# Altium schematic sheet sensors.SchDoc
size A4
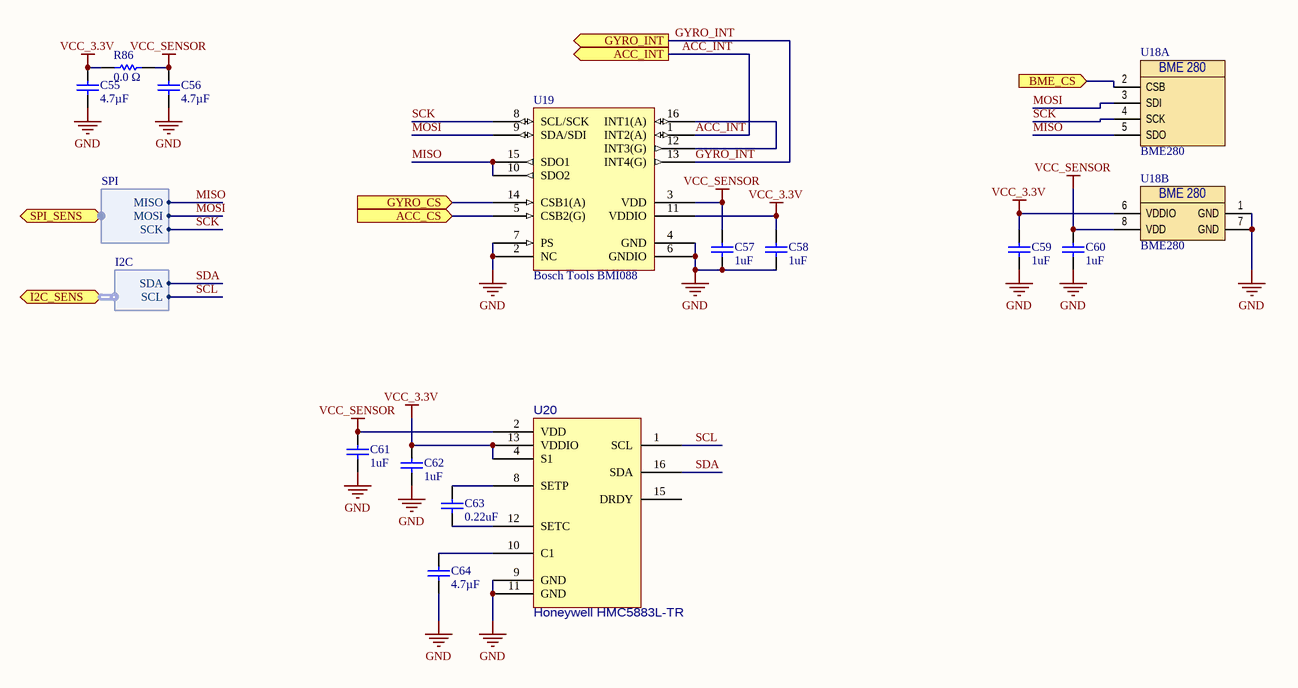
[diagram p0: sensors.SchDoc]

## Parts
C55  4.7µF  [CAPC1608X90X35NL15T15]
C56  4.7µF  [CAPC1608X90X35NL15T15]
C57  1uF  [CAPC1005X56X25NL10T15]
C58  1uF  [CAPC1005X56X25NL10T15]
C59  1uF  [CAPC1005X56X25NL10T15]
C60  1uF  [CAPC1005X56X25NL10T15]
C61  1uF  [CAPC1005X56X25NL10T15]
C62  1uF  [CAPC1005X56X25NL10T15]
C63  0.22uF  [CAPC1005X56X25NL10T15]
C64  4.7µF  [CAPC1608X90X35NL15T15]
R86  0.0 Ω  [RESC1608X55X25LL10T15]
U18  BME280  [PCB-pz4u251hci7fplawf7tn-1]  (parts A,B of 2)
U19  Bosch Tools BMI088  [PCB-rx9ouf6ws7u2trts4ghn-1]
U20  Honeywell HMC5883L-TR  [PCB-2968744-2]

## Ports
ACC_CS (in), ACC_INT (out), BME_CS (in), GYRO_CS (in), GYRO_INT (out), I2C_SENS (harness I2C), SPI_SENS (harness SPI)

## Harnesses
SPI: MOSI, MISO, SCK
I2C: SCL, SDA

## Nets
GND: C55.1 C56.1 C57.1 C58.1 C59.1 C60.1 C61.1 C62.1 C64.2 U18.1(GND) U18.7(GND) U19.2(NC) U19.4(GND) U19.6(GNDIO) U19.7(PS) U20.9(GND) U20.11(GND)
VCC_3.3V: C55.2 C58.2 C59.2 C62.2 R86.2 U18.6(VDDIO) U19.11(VDDIO) U20.4(S1) U20.13(VDDIO)
VCC_SENSOR: C56.2 C57.2 C60.2 C61.2 R86.1 U18.8(VDD) U19.3(VDD) U20.2(VDD)
ACC_CS: U19.5(CSB2(G)) ; port ACC_CS
ACC_INT: U19.1(INT2(A)) ; port ACC_INT
BME_CS: U18.2(CSB) ; port BME_CS
GYRO_CS: U19.14(CSB1(A)) ; port GYRO_CS
GYRO_INT: U19.13(INT4(G)) ; port GYRO_INT
MISO: U18.5(SDO) U19.10(SDO2) U19.15(SDO1) ; port SPI_SENS.MISO
MOSI: U18.3(SDI) U19.9(SDA/SDI) ; port SPI_SENS.MOSI
SCK: U18.4(SCK) U19.8(SCL/SCK) ; port SPI_SENS.SCK
SCL: U20.1(SCL) ; port I2C_SENS.SCL
SDA: U20.16(SDA) ; port I2C_SENS.SDA
NetC63_1: C63.1 U20.12(SETC)
NetC63_2: C63.2 U20.8(SETP)
NetC64_1: C64.1 U20.10(C1)
NetU19_12: U19.12(INT3(G)) U19.16(INT1(A))

Not connected (* = marked no-connect by the designer): U20 15(DRDY)

## Notes on the sheet
- (in symbol CMP-19345792-15, part A) BME 280
- (in symbol CMP-19345792-15, part B) BME 280

## Library data of the parts
C55 C56 C64 = CMP-147010-6: 0603 4.7 uF 10 V ±10 % Tolerance X5R SMT Multilayer Ceramic Capacitor; Voltage Rating (DC): 10.0 V; Capacitance Tolerance: ±10%; Lead-Free Status: Lead Free; Capacitance: 4.70 µF; Operating Temperature: -55.0 °C to 85.0 °C; Dielectric Characteristic: X5R; OctopartID: 876b4eec68d658ac; Octopart URL: https://octopart.com/cc0603krx5r6bb475-yageo-9292507; Number of Pins: 2; Mounting Style: Surface Mount; RoHS: Compliant
C57-C62 = CMP-126963-2: Cap Ceramic 1uF 10V X5R 20% SMD 0402 85C Paper T/R; Manufacturer Part Number: 0402ZD105MAT2A; Capacitance: 1e-06 F; Lead-Free Status: Lead Free; Voltage Rating (DC): 10.0 V; Capacitance Tolerance: ±20%; Case/Package: 0402; Dielectric Characteristic: X5R; Mounting Style: Surface Mount; Number of Pins: 2; Octopart Url: https://octopart.com/0402zd105mat2a-avx+interconnect+%2F+elco-7158066; OctopartID: dd611406c13502a6; Packaging: Cut Tape (CT); REACH SVHC Compliance: No SVHC; RoHS: Compliant
C63 = CMP-126172-3: AVX   04026D224KAT2A   CAP, MLCC, X5R, 220NF, 6.3V, 0402; Capacitance: 2.2e-07 F; Capacitance Tolerance: ±10%; Dielectric Material: Ceramic Multilayer; Lead-Free Status: Lead Free; Mounting Style: Surface Mount; Manufacturer Part Number: 04026D224KAT2A; Number of Pins: 2; Voltage Rating (DC): 6.3 V; Size-Length: 0.001 m; RoHS: Compliant; REACH SVHC Compliance: No SVHC; Case/Package: 0402; Size-Height: 0.00056 m; Octopart Url: https://octopart.com/04026d224kat2a-avx+interconnect+%2F+elco-194761; Dielectric Characteristic: X5R; OctopartID: 3065f96dedcaefa2; Size-Width: 0.0005 m
R86 = CMP-3661350-4: Thick Film Resistors - SMD ZERO OHM JUMPER; Voltage Rating (DC): 50.0 V; Lead-Free Status: Lead Free; Resistance Tolerance: ±5%; Octopart Url: https://octopart.com/rc0603jr-130rl-yageo-9297262; Case/Package: 0603; OctopartID: ee3b27bc163331fc; Resistance: 0.0 Ω
U18 = CMP-19345792-15: Pressure, Temperature and Humidity Sensor Digital Output 1.8V 8-Pin LGA T/R; Lead-Free Status: Lead Free; Octopart URL: https://octopart.com/bme280-bosch+tools-52931981
U19 = CMP-3c8ff0f6eb07e348-2: BMI088 Series 3.6 V 6 Axis Digital Output Accelerometer Motion Sensor - LGA-16; Lead-Free Status: Lead Free; Manufacturer Part Number: BMI088; Octopart URL: https://octopart.com/bmi088-bosch+tools-91484910; OctopartID: 3c8ff0f6eb07e348; RoHS: Compliant
U20 = CMP-2968744-5: MAGNETIC SENSOR ON TAPE AND REEL; Manufacturer Part Number: HMC5883L-TR; Number of Pins: 16; OctopartID: b1a37a0cbc0b6e64; Octopart Url: http://octopart.com/hmc5883l-tr-honeywell-44378318; RoHS: Compliant